# Altium project PCB_Project.PrjPcb
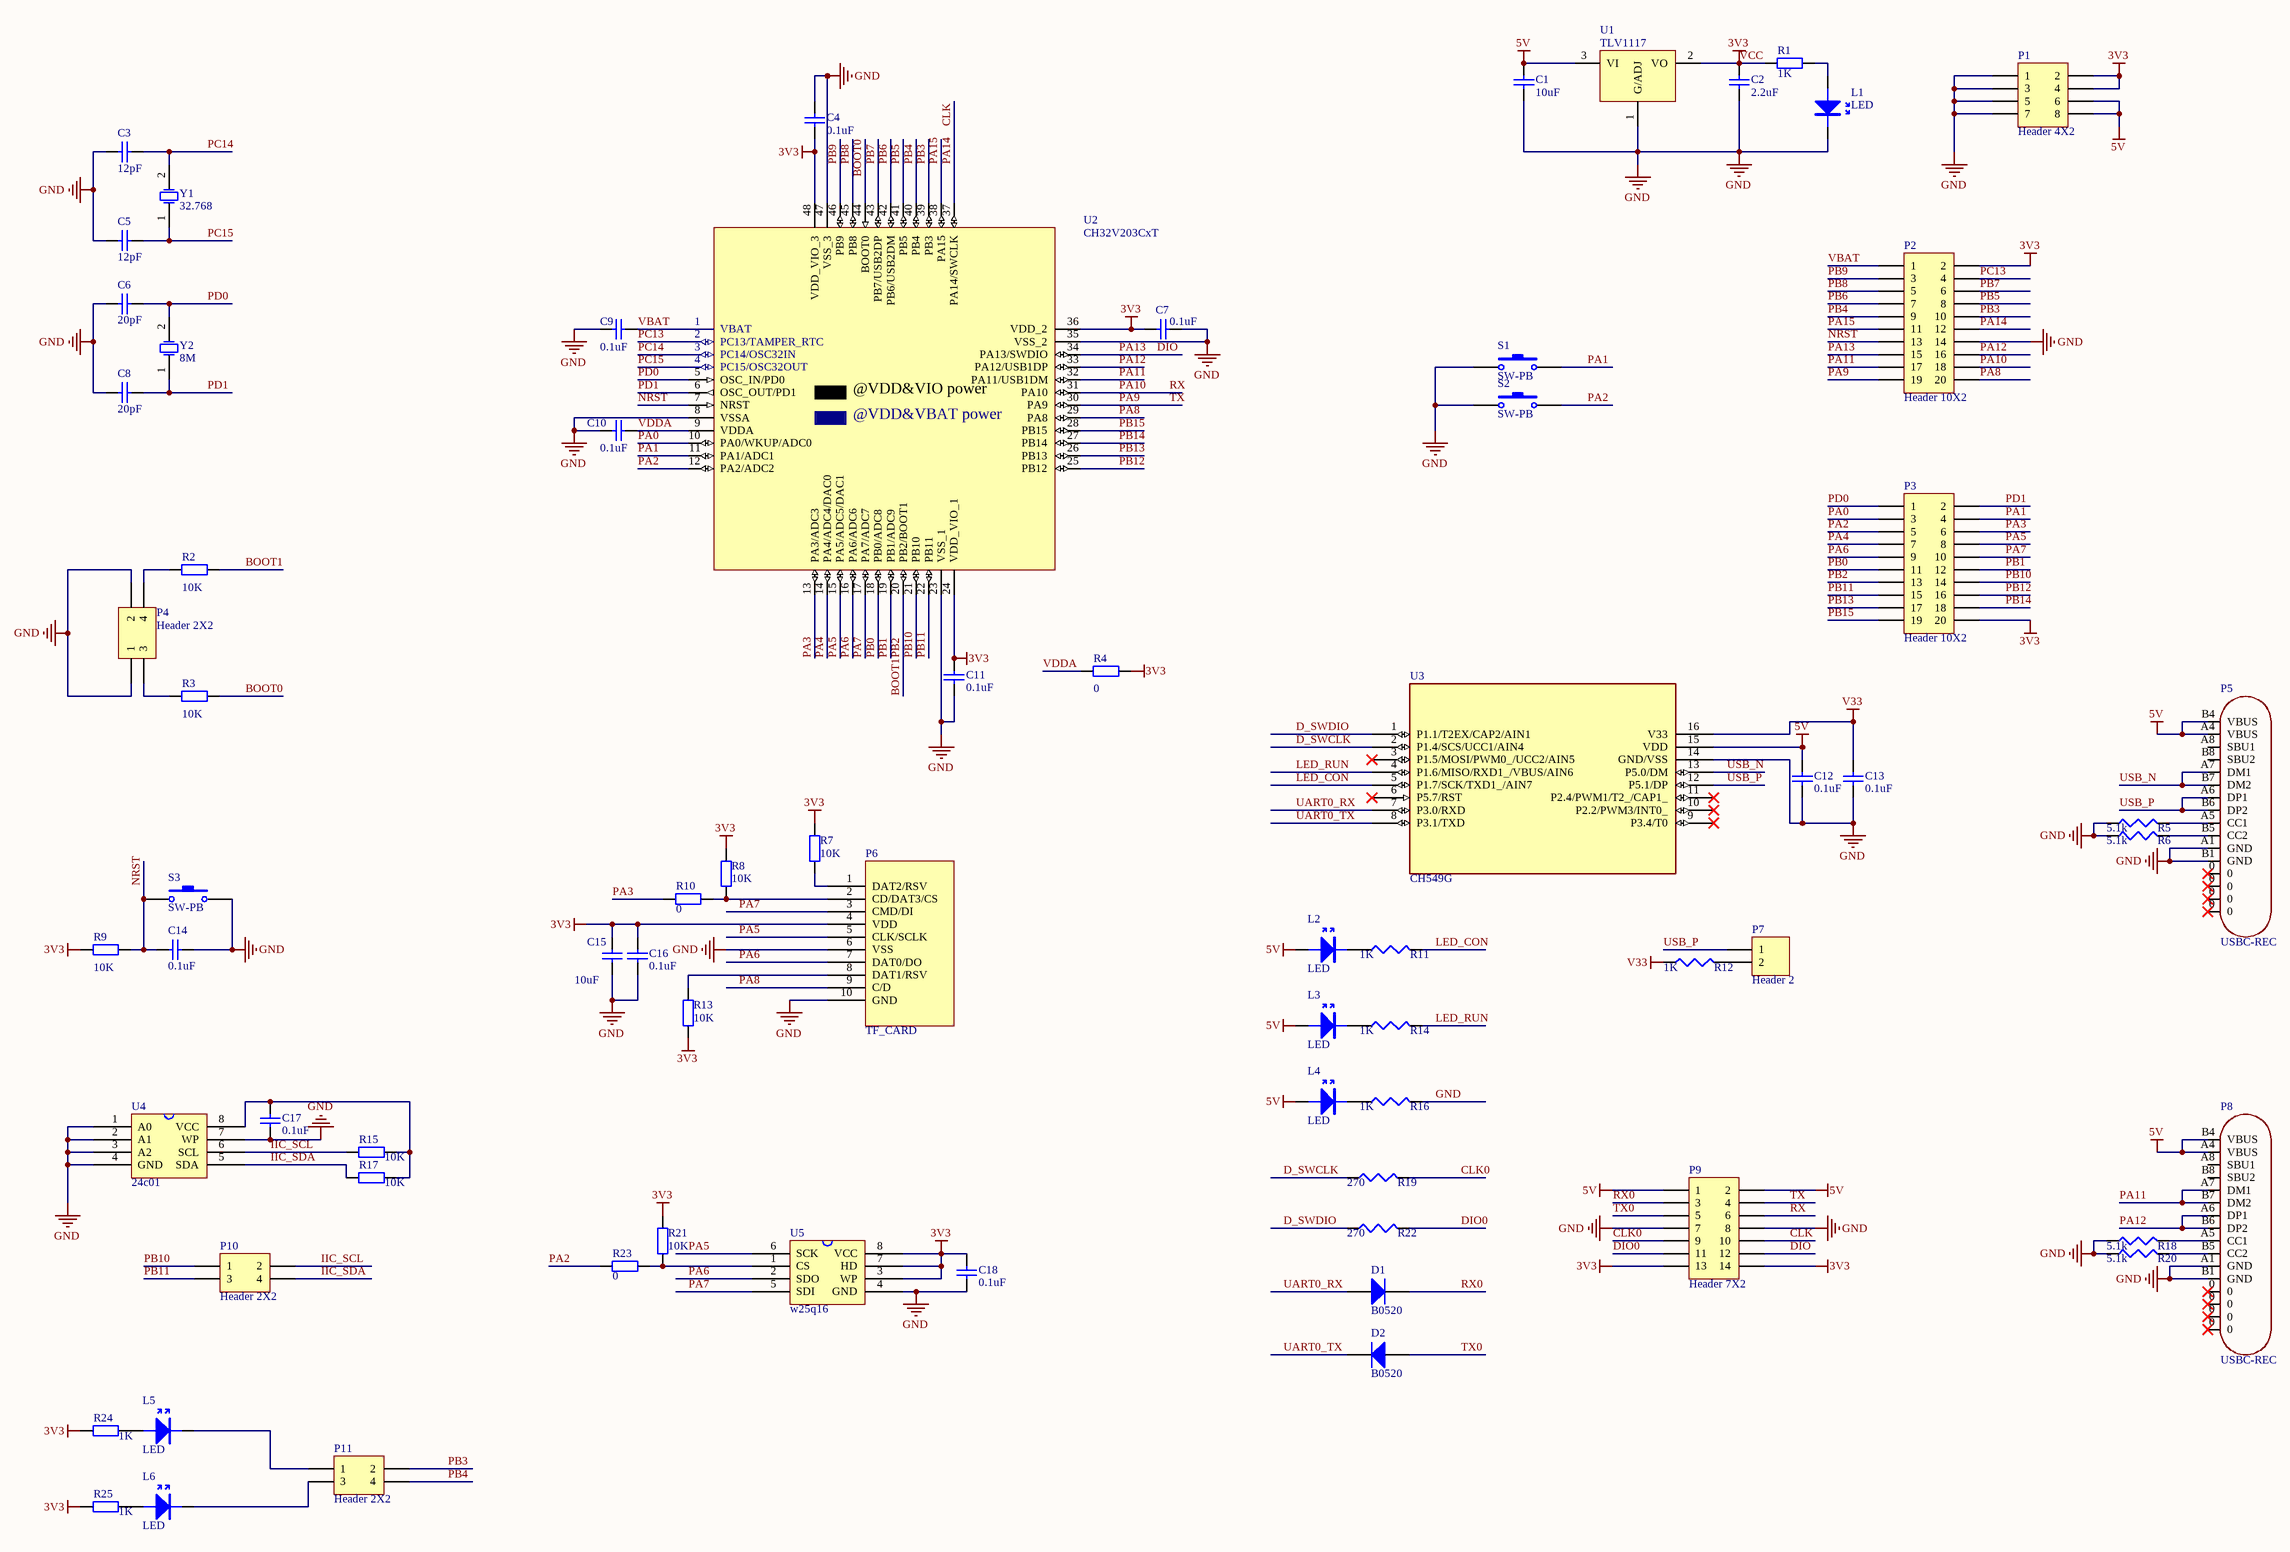
[diagram p0: Sheet1.SchDoc]
1 sheet, 72 parts. Net scope: global (net labels, ports and power ports of the same name join across sheets).
Board file: PCB1.PcbDoc

## Sheet Sheet1.SchDoc
size A2; SheetNumber: 1; SheetTotal: 1

### Parts
C1  10uF  [1206]
C2  2.2uF  [0805]
C3  12pF  [0805]
C4  0.1uF  [0805]
C5  12pF  [0805]
C6  20pF  [0805]
C7  0.1uF  [0805]
C8  20pF  [0805]
C9  value 0.1uF  [0805]  (hidden comment: Cap)
C10  value 0.1uF  [0805]  (hidden comment: Cap)
C11  0.1uF  [0805]
C12  0.1uF  [0805]
C13  0.1uF  [0805]
C14  0.1uF  [0805]
C15  10uF  [0805]
C16  0.1uF  [0805]
C17  0.1uF  [0805]
C18  0.1uF  [0805]
D1  B0520  [SOD-123]
D2  B0520  [SOD-123]
L1  LED  [0805]
L2  LED  [0805]
L3  LED  [0805]
L4  LED  [0805]
L5  LED  [0805]
L6  LED  [0805]
P1  Header 4X2  [HDR2X4]
P2  Header 10X2  [HDR2X10]
P3  Header 10X2  [HDR2X10]
P4  Header 2X2  [HDR2X2]
P5  USBC-REC  [TYPE-C-Receptacle-2.0]
P6  TF_CARD  [TF_CARD]
P7  Header 2  [HDR1X2]
P8  USBC-REC  [TYPE-C-Receptacle-2.0]
P9  Header 7X2  [HDR2X7]
P10  Header 2X2  [HDR2X2]
P11  Header 2X2  [HDR2X2]
R1  1K  [0805]
R2  10K  [0805]
R3  10K  [0805]
R4  0  [0805]
R5  5.1K  [0805]
R6  5.1K  [0805]
R7  10K  [0805]
R8  10K  [0805]
R9  10K  [0805]
R10  0  [0805]
R11  1K  [0805]
R12  1K  [0805]
R13  10K  [0805]
R14  1K  [0805]
R15  10K  [0805]
R16  1K  [0805]
R17  10K  [0805]
R18  5.1K  [0805]
R19  270  [0805]
R20  5.1K  [0805]
R21  10K  [0805]
R22  270  [0805]
R23  0  [0805]
R24  1K  [0805]
R25  1K  [0805]
S1  SW-PB  [sw - 3*6*2.5]
S2  SW-PB  [sw - 3*6*2.5]
S3  SW-PB  [sw - 3*6*2.5]
U1  TLV1117  [SOT-223]
U2  CH32V203CxT  [LQFP48]
U3  CH549G  [SOP16]
U4  24c01  [SOIC-8_208mil]
U5  w25q16  [SOIC-8_208mil]
Y1  32.768  [XT3225]
Y2  8M  [XT3225]

### Nets
5V: C1.2 C12.2 L2.1(A) L3.1(A) L4.1(A) P1.6 P1.8 P5.A4(VBUS) P5.B4(VBUS) P8.A4(VBUS) P8.B4(VBUS) P9.1 P9.2 U1.3(VI) U3.15(VDD)
GND: C1.1 C2.1 C3.1 C4.1 C5.2 C6.1 C7.1 C8.2 C9.1 C10.1 C11.1 C12.1 C13.1 C14.1 C15.1 C16.1 C17.1 C18.1 L1.2(K) P1.1 P1.3 P1.5 P1.7 P2.14 P4.1 P4.2 P5.A1(GND) P5.B1(GND) P6.6(VSS) P6.10(GND) P8.A1(GND) P8.B1(GND) P9.7 P9.8 R5.1 R6.1 R16.2 R18.1 R20.1 S1.1 S2.1 S3.2 U1.1(G/ADJ) U2.8(VSSA) U2.23(VSS_1) U2.35(VSS_2) U2.47(VSS_3) U3.14(GND/VSS) U4.1(A0) U4.2(A1) U4.3(A2) U4.4(GND) U4.7(WP) U5.4(GND)
V33: C13.2 R12.1 U3.16(V33)
VCC: C2.2 C4.2 C7.2 C11.2 C15.2 C16.2 C18.2 P1.2 P1.4 P2.2 P3.20 P6.4(VDD) P9.13 P9.14 R1.2 R4.2 R7.2 R8.2 R9.1 R13.1 R21.2 R24.1 R25.1 U1.2(VO) U2.24(VDD_VIO_1) U2.36(VDD_2) U2.48(VDD_VIO_3) U5.3(WP) U5.7(HD) U5.8(VCC)  [also labelled 3V3]
BOOT0: R3.2 U2.44(BOOT0)
BOOT1: P3.13 R2.2 U2.20(PB2/BOOT1)  [also labelled PB2]
CLK: P2.12 P9.10 U2.37(PA14/SWCLK)  [also labelled PA14]
CLK0: P9.9 R19.2
D_SWCLK: R19.1 U3.2(P1.4/SCS/UCC1/AIN4)
D_SWDIO: R22.1 U3.1(P1.1/T2EX/CAP2/AIN1)
DIO: P2.15 P9.12 U2.34(PA13/SWDIO)  [also labelled PA13]
DIO0: P9.11 R22.2
IIC_SCL: P10.2 R15.1 U4.6(SCL)
IIC_SDA: P10.4 R17.1 U4.5(SDA)
LED_CON: R11.2 U3.5(P1.7/SCK/TXD1_/AIN7)
LED_RUN: R14.2 U3.4(P1.6/MISO/RXD1_/VBUS/AIN6)
NRST: C14.2 P2.13 R9.2 S3.1 U2.7(NRST)
PA0: P3.3 U2.10(PA0/WKUP/ADC0)
PA1: P3.4 S1.2 U2.11(PA1/ADC1)
PA2: P3.5 R23.2 S2.2 U2.12(PA2/ADC2)
PA3: P3.6 R10.2 U2.13(PA3/ADC3)
PA4: P3.7 U2.14(PA4/ADC4/DAC0)
PA5: P3.8 P6.5(CLK/SCLK) U2.15(PA5/ADC5/DAC1) U5.6(SCK)
PA6: P3.9 P6.7(DAT0/DO) U2.16(PA6/ADC6) U5.2(SDO)
PA7: P3.10 P6.3(CMD/DI) U2.17(PA7/ADC7) U5.5(SDI)
PA8: P2.20 P6.9(C/D) U2.29(PA8)
PA9: P2.19 P9.4 U2.30(PA9)  [also labelled TX]
PA10: P2.18 P9.6 U2.31(PA10)  [also labelled RX]
PA11: P2.17 P8.A7(DM1) P8.B7(DM2) U2.32(PA11/USB1DM)
PA12: P2.16 P8.A6(DP1) P8.B6(DP2) U2.33(PA12/USB1DP)
PA15: P2.11 U2.38(PA15)
PB0: P3.11 U2.18(PB0/ADC8)
PB1: P3.12 U2.19(PB1/ADC9)
PB3: P2.10 P11.2 U2.39(PB3)
PB4: P2.9 P11.4 U2.40(PB4)
PB5: P2.8 U2.41(PB5)
PB6: P2.7 U2.42(PB6/USB2DM)
PB7: P2.6 U2.43(PB7/USB2DP)
PB8: P2.5 U2.45(PB8)
PB9: P2.3 U2.46(PB9)
PB10: P3.14 P10.1 U2.21(PB10)
PB11: P3.15 P10.3 U2.22(PB11)
PB12: P3.16 U2.25(PB12)
PB13: P3.17 U2.26(PB13)
PB14: P3.18 U2.27(PB14)
PB15: P3.19 U2.28(PB15)
PC13: P2.4 U2.2(PC13/TAMPER_RTC)
PC14: C3.2 U2.3(PC14/OSC32IN) Y1.2(OSC2)
PC15: C5.1 U2.4(PC15/OSC32OUT) Y1.1(OSC1)
PD0: C6.2 P3.1 U2.5(OSC_IN/PD0) Y2.2(OSC2)
PD1: C8.1 P3.2 U2.6(OSC_OUT/PD1) Y2.1(OSC1)
RX0: D1.2(K) P9.3
TX0: D2.1(A) P9.5
UART0_RX: D1.1(A) U3.7(P3.0/RXD)
UART0_TX: D2.2(K) U3.8(P3.1/TXD)
USB_N: P5.A7(DM1) P5.B7(DM2) U3.13(P5.0/DM)
USB_P: P5.A6(DP1) P5.B6(DP2) P7.1 U3.12(P5.1/DP)
VBAT: C9.2 P2.1 U2.1(VBAT)
VDDA: C10.2 R4.1 U2.9(VDDA)
NetC17_2: C17.2 R15.2 R17.2 U4.8(VCC)
NetL1_1: L1.1(A) R1.1
NetL2_2: L2.2(K) R11.1
NetL3_2: L3.2(K) R14.1
NetL4_2: L4.2(K) R16.1
NetL5_1: L5.1(A) R24.2
NetL5_2: L5.2(K) P11.1
NetL6_1: L6.1(A) R25.2
NetL6_2: L6.2(K) P11.3
NetP4_3: P4.3 R3.1
NetP4_4: P4.4 R2.1
NetP5_A5: P5.A5(CC1) R5.2
NetP5_B5: P5.B5(CC2) R6.2
NetP6_1: P6.1(DAT2/RSV) R7.1
NetP6_2: P6.2(CD/DAT3/CS) R8.1 R10.1
NetP6_8: P6.8(DAT1/RSV) R13.2
NetP7_2: P7.2 R12.2
NetP8_A5: P8.A5(CC1) R18.2
NetP8_B5: P8.B5(CC2) R20.2
NetR21_1: R21.1 R23.1 U5.1(CS)

Not connected (* = marked no-connect by the designer): P5 0* A8(SBU1) B8(SBU2); P8 0* A8(SBU1) B8(SBU2); U3 3(P1.5/MOSI/PWM0_/UCC2/AIN5)* 6(P5.7/RST)* 9(P3.4/T0)* 10(P2.2/PWM3/INT0_)* 11(P2.4/PWM1/T2_/CAP1_)*

### Notes on the sheet
- (in symbol CH32V203CxT) @VDD&VIO power; @VDD&VBAT power

### Library data of the parts
C1 = Cap: 坦电容; Published: 8-Jun-2000; LatestRevisionDate: 17-Jul-2002; LatestRevisionNote: Re-released for DXP Platform.; PackageReference: RAD-0.3; Publisher: Altium Limited; PackageDescription: Radial Cap, Thru-Hole; 2 Leads; 0.3 in Pin Spacing; Value: 10uF
C2-C18 = Cap: Capacitor; Published: 8-Jun-2000; LatestRevisionDate: 17-Jul-2002; LatestRevisionNote: Re-released for DXP Platform.; PackageReference: RAD-0.3; Publisher: Altium Limited; PackageDescription: Radial Cap, Thru-Hole; 2 Leads; 0.3 in Pin Spacing
  C2: Value: 2.2uF
  C3 C5: Value: 12pF
  C4 C7 C11-C14 C16-C18: Value: 0.1uF
  C6 C8: Value: 20pF
  C15: Value: 10uF
D1 D2 = Diode: Default Diode; Published: 8-Jun-2000; LatestRevisionDate: 17-Jul-2002; LatestRevisionNote: Re-released for DXP Platform.; PackageVersion: Sep-1996; PackageReference: SMC; Publisher: Altium Limited; PackageDescription: DO-214-AB/SMC; 2 C-Bend Leads; Body 7.9 x 5.9 mm, inc. leads (LxW); Code_JEDEC: DO-214-AB
P1 = Header 4X2: Header, 4-Pin, Dual row; LatestRevisionDate: 17-Jul-2002; LatestRevisionNote: Re-released for DXP Platform.; Publisher: Altium Limited
P2 P3 = Header 10X2: Header, 10-Pin, Dual row; LatestRevisionDate: 17-Jul-2002; LatestRevisionNote: Re-released for DXP Platform.; Publisher: Altium Limited
P4 P10 P11 = Header 2X2: Header, 2-Pin, Dual row; LatestRevisionDate: 17-Jul-2002; LatestRevisionNote: Re-released for DXP Platform.; Publisher: Altium Limited
P5 P8 = USBC-REC: USB Type-C USB
P6 = TF_CARD: TF card interface
P7 = Header 2: Header, 2-Pin; LatestRevisionDate: 17-Jul-2002; LatestRevisionNote: Re-released for DXP Platform.; Publisher: Altium Limited
P9 = Header 7X2: Header, 7-Pin, Dual row; LatestRevisionDate: 17-Jul-2002; LatestRevisionNote: Re-released for DXP Platform.; Publisher: Altium Limited
R1-R4 R7-R10 R13 R15 R17 R21 R23-R25 = Res2: Resistor; Published: 8-Jun-2000; LatestRevisionDate: 17-Jul-2002; LatestRevisionNote: Re-released for DXP Platform.; PackageReference: AXIAL-0.4; Publisher: Altium Limited; PackageDescription: Axial Device, Thru-Hole; 2 Leads; 0.4 in Pin Spacing
  R1 R24 R25: Value: 1K
  R2 R3 R7-R9 R13 R15 R17 R21: Value: 10K
  R4 R10 R23: Value: 0
R5 R6 R11 R12 R14 R16 R18-R20 R22 = Res3: Resistor; Published: 8-Jun-2000; LatestRevisionDate: 29-May-2009; LatestRevisionNote: IPC-7351 Footprint Added.; PackageReference: J1-0603; Publisher: Altium Limited; PackageDescription: Chip Resistor
  R5 R6 R18 R20: Value: 5.1k
  R11 R12 R14 R16: Value: 1K
  R19 R22: Value: 270
S1-S3 = SW-PB: Switch; Published: 24-Mar-1999; LatestRevisionDate: 17-Jul-2002; LatestRevisionNote: Re-released for DXP Platform.; PackageReference: SPST-2; Publisher: Altium Limited; PackageDescription: Switch; 2 Leads
U1 = LDO1117: LDO
U2 = CH32V203CxT: RISC-V MCU,144MHz, 2*USB FS, CAN
U3 = CH549G: 8bit MCS51 MCU with ADC & USB type-C host & device & dual UART & SPI
Y1 Y2 = XTAL: Crystal Oscillator; Published: 8-Jun-2000; LatestRevisionDate: 17-Jul-2002; LatestRevisionNote: Re-released for DXP Platform.; PackageReference: R38; Publisher: Altium Limited; PackageDescription: Crystal, Thru-Hole; 2 Leads; Body 3.1 x 8.2 mm (Dia.xH)